# Altium schematic sheet IO2.SchDoc
size 359 x 219 mm; SheetNumber: 3; SheetTotal: 7
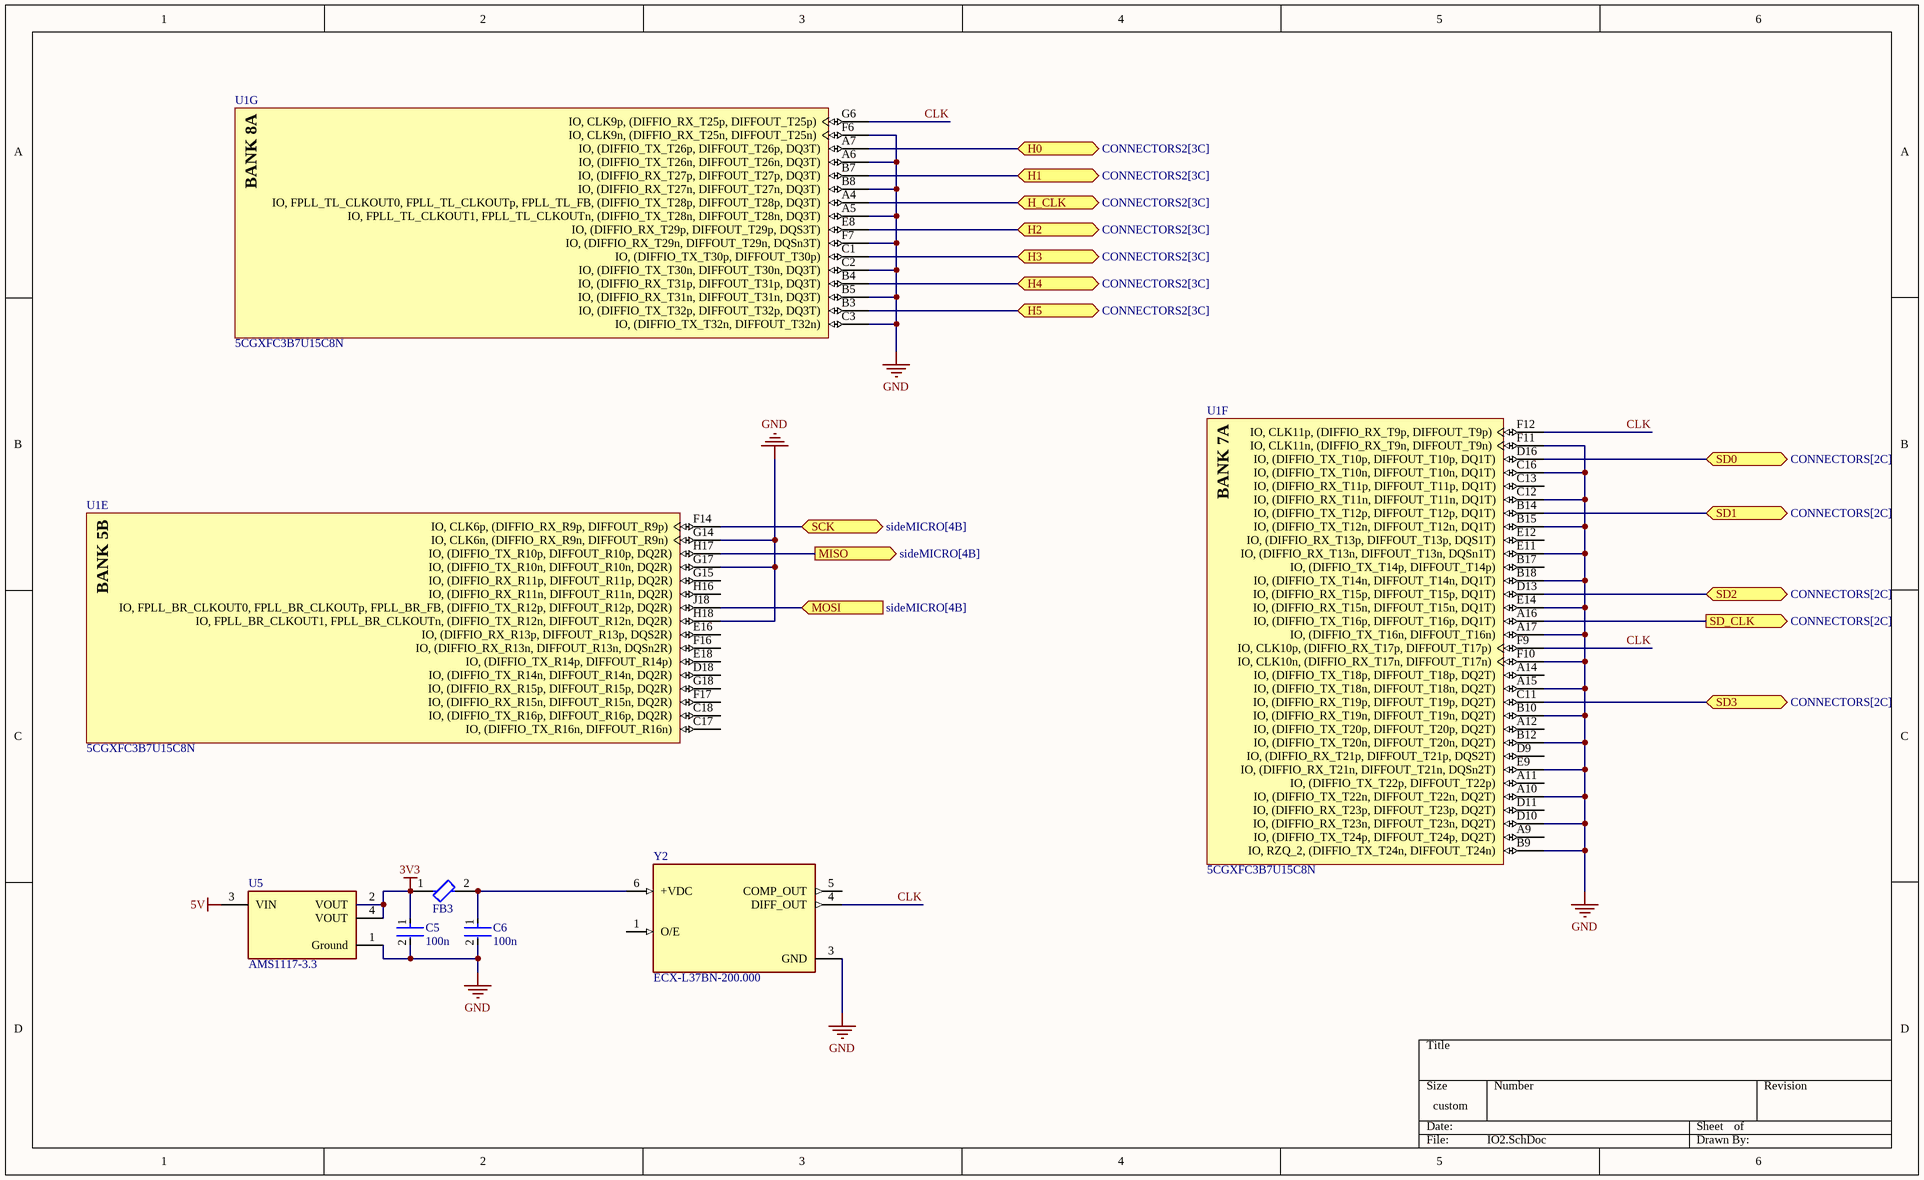
[diagram p0: IO2.SchDoc]

## Parts
C5  100n  [FP-CL10-IPC_C]
C6  100n  [FP-CL10-IPC_C]
FB3  BLM18KG121TN1D  [FP-BLM18-0_15-t0_6-d1_2-IPC_A]  (value not drawn)
U1  5CGXFC3B7U15C8N  [ALTR-UBGA324_A-150]  (parts E,F,G of 12)
U5  AMS1117-3.3  [FP-AMS1117-IPC_C]
Y2  ECX-L37BN-200.000  [OSC_ECX-L37BN-200.000]

## Ports
H0 (bidir, see CONNECTORS2[3C]), H1 (bidir, see CONNECTORS2[3C]), H2 (bidir, see CONNECTORS2[3C]), H3 (bidir, see CONNECTORS2[3C]), H4 (bidir, see CONNECTORS2[3C]), H5 (bidir, see CONNECTORS2[3C]), H_CLK (bidir, see CONNECTORS2[3C]), MISO (out, see sideMICRO[4B]), MOSI (in, see sideMICRO[4B]), SCK (bidir, see sideMICRO[4B]), SD0 (bidir, see CONNECTORS[2C]), SD1 (bidir, see CONNECTORS[2C]), SD2 (bidir, see CONNECTORS[2C]), SD3 (bidir, see CONNECTORS[2C]), SD_CLK (out, see CONNECTORS[2C])

## Nets
3V3: C5.1 FB3.1 U5.2(VOUT) U5.4(VOUT)
5V: U5.3(VIN)
GND: C5.2 C6.2 U1.A5(IO,_FPLL_TL_CLKOUT1,_FPLL_TL_CLKOUTn,_(DIFFIO_TX_T28n,_DIFFOUT_T28n,_DQ3T)) U1.A6(IO,_(DIFFIO_TX_T26n,_DIFFOUT_T26n,_DQ3T)) U1.A10(IO,_(DIFFIO_TX_T22n,_DIFFOUT_T22n,_DQ2T)) U1.A15(IO,_(DIFFIO_TX_T18n,_DIFFOUT_T18n,_DQ2T)) U1.A17(IO,_(DIFFIO_TX_T16n,_DIFFOUT_T16n)) U1.B5(IO,_(DIFFIO_RX_T31n,_DIFFOUT_T31n,_DQ3T)) U1.B8(IO,_(DIFFIO_RX_T27n,_DIFFOUT_T27n,_DQ3T)) U1.B9(IO,_RZQ_2,_(DIFFIO_TX_T24n,_DIFFOUT_T24n)) U1.B10(IO,_(DIFFIO_RX_T19n,_DIFFOUT_T19n,_DQ2T)) U1.B12(IO,_(DIFFIO_TX_T20n,_DIFFOUT_T20n,_DQ2T)) U1.B15(IO,_(DIFFIO_TX_T12n,_DIFFOUT_T12n,_DQ1T)) U1.B18(IO,_(DIFFIO_TX_T14n,_DIFFOUT_T14n,_DQ1T)) U1.C2(IO,_(DIFFIO_TX_T30n,_DIFFOUT_T30n,_DQ3T)) U1.C3(IO,_(DIFFIO_TX_T32n,_DIFFOUT_T32n)) U1.C12(IO,_(DIFFIO_RX_T11n,_DIFFOUT_T11n,_DQ1T)) U1.C16(IO,_(DIFFIO_TX_T10n,_DIFFOUT_T10n,_DQ1T)) U1.D10(IO,_(DIFFIO_RX_T23n,_DIFFOUT_T23n,_DQ2T)) U1.E9(IO,_(DIFFIO_RX_T21n,_DIFFOUT_T21n,_DQSn2T)) U1.E11(IO,_(DIFFIO_RX_T13n,_DIFFOUT_T13n,_DQSn1T)) U1.E14(IO,_(DIFFIO_RX_T15n,_DIFFOUT_T15n,_DQ1T)) U1.F6(IO,_CLK9n,_(DIFFIO_RX_T25n,_DIFFOUT_T25n)) U1.F7(IO,_(DIFFIO_RX_T29n,_DIFFOUT_T29n,_DQSn3T)) U1.F10(IO,_CLK10n,_(DIFFIO_RX_T17n,_DIFFOUT_T17n)) U1.F11(IO,_CLK11n,_(DIFFIO_RX_T9n,_DIFFOUT_T9n)) U1.G14(IO,_CLK6n,_(DIFFIO_RX_R9n,_DIFFOUT_R9n)) U1.G17(IO,_(DIFFIO_TX_R10n,_DIFFOUT_R10n,_DQ2R)) U1.H18(IO,_FPLL_BR_CLKOUT1,_FPLL_BR_CLKOUTn,_(DIFFIO_TX_R12n,_DIFFOUT_R12n,_DQ2R)) U5.1(Ground) Y2.3(GND)
CLK: U1.F9(IO,_CLK10p,_(DIFFIO_RX_T17p,_DIFFOUT_T17p)) U1.F12(IO,_CLK11p,_(DIFFIO_RX_T9p,_DIFFOUT_T9p)) U1.G6(IO,_CLK9p,_(DIFFIO_RX_T25p,_DIFFOUT_T25p)) Y2.4(DIFF_OUT)
H0: U1.A7(IO,_(DIFFIO_TX_T26p,_DIFFOUT_T26p,_DQ3T)) ; port H0
H1: U1.B7(IO,_(DIFFIO_RX_T27p,_DIFFOUT_T27p,_DQ3T)) ; port H1
H2: U1.E8(IO,_(DIFFIO_RX_T29p,_DIFFOUT_T29p,_DQS3T)) ; port H2
H3: U1.C1(IO,_(DIFFIO_TX_T30p,_DIFFOUT_T30p)) ; port H3
H4: U1.B4(IO,_(DIFFIO_RX_T31p,_DIFFOUT_T31p,_DQ3T)) ; port H4
H5: U1.B3(IO,_(DIFFIO_TX_T32p,_DIFFOUT_T32p,_DQ3T)) ; port H5
H_CLK: U1.A4(IO,_FPLL_TL_CLKOUT0,_FPLL_TL_CLKOUTp,_FPLL_TL_FB,_(DIFFIO_TX_T28p,_DIFFOUT_T28p,_DQ3T)) ; port H_CLK
MISO: U1.H17(IO,_(DIFFIO_TX_R10p,_DIFFOUT_R10p,_DQ2R)) ; port MISO
MOSI: U1.J18(IO,_FPLL_BR_CLKOUT0,_FPLL_BR_CLKOUTp,_FPLL_BR_FB,_(DIFFIO_TX_R12p,_DIFFOUT_R12p,_DQ2R)) ; port MOSI
SCK: U1.F14(IO,_CLK6p,_(DIFFIO_RX_R9p,_DIFFOUT_R9p)) ; port SCK
SD0: U1.D16(IO,_(DIFFIO_TX_T10p,_DIFFOUT_T10p,_DQ1T)) ; port SD0
SD1: U1.B14(IO,_(DIFFIO_TX_T12p,_DIFFOUT_T12p,_DQ1T)) ; port SD1
SD2: U1.D13(IO,_(DIFFIO_RX_T15p,_DIFFOUT_T15p,_DQ1T)) ; port SD2
SD3: U1.C11(IO,_(DIFFIO_RX_T19p,_DIFFOUT_T19p,_DQ2T)) ; port SD3
SD_CLK: U1.A16(IO,_(DIFFIO_TX_T16p,_DIFFOUT_T16p,_DQ1T)) ; port SD_CLK
NetC6_1: C6.1 FB3.2 Y2.6(+VDC)

Not connected (* = marked no-connect by the designer): U1 A9(IO,_(DIFFIO_TX_T24p,_DIFFOUT_T24p,_DQ2T)) A11(IO,_(DIFFIO_TX_T22p,_DIFFOUT_T22p)) A12(IO,_(DIFFIO_TX_T20p,_DIFFOUT_T20p,_DQ2T)) A14(IO,_(DIFFIO_TX_T18p,_DIFFOUT_T18p,_DQ2T)) B17(IO,_(DIFFIO_TX_T14p,_DIFFOUT_T14p)) C13(IO,_(DIFFIO_RX_T11p,_DIFFOUT_T11p,_DQ1T)) C17(IO,_(DIFFIO_TX_R16n,_DIFFOUT_R16n)) C18(IO,_(DIFFIO_TX_R16p,_DIFFOUT_R16p,_DQ2R)) D9(IO,_(DIFFIO_RX_T21p,_DIFFOUT_T21p,_DQS2T)) D11(IO,_(DIFFIO_RX_T23p,_DIFFOUT_T23p,_DQ2T)) D18(IO,_(DIFFIO_TX_R14n,_DIFFOUT_R14n,_DQ2R)) E12(IO,_(DIFFIO_RX_T13p,_DIFFOUT_T13p,_DQS1T)) E16(IO,_(DIFFIO_RX_R13p,_DIFFOUT_R13p,_DQS2R)) E18(IO,_(DIFFIO_TX_R14p,_DIFFOUT_R14p)) F16(IO,_(DIFFIO_RX_R13n,_DIFFOUT_R13n,_DQSn2R)) F17(IO,_(DIFFIO_RX_R15n,_DIFFOUT_R15n,_DQ2R)) G15(IO,_(DIFFIO_RX_R11p,_DIFFOUT_R11p,_DQ2R)) G18(IO,_(DIFFIO_RX_R15p,_DIFFOUT_R15p,_DQ2R)) H16(IO,_(DIFFIO_RX_R11n,_DIFFOUT_R11n,_DQ2R)); Y2 1(O/E) 5(COMP_OUT)

## Notes on the sheet
- (in symbol CMP-0469-00059-2, part E) BANK 5B
- (in symbol CMP-0469-00059-2, part F) BANK 7A
- (in symbol CMP-0469-00059-2, part G) BANK 8A

## Library data of the parts
C5 C6 = CMP-13271-003017-1: Cap Ceramic 4.7uF 10V X5R ±10% Pad SMD 0603 +85°C T/R; Capacitance: 4.7uF; Case/Package: 0603; Packaging: Tape and Reel; Width: 0.031inch; Contact Plating: Tin; Thickness: 0.035inch; Package Quantity: 1; Voltage Rating: 10V; Case Code (Metric): 1608; Case Code (Imperial): 0603; Depth: 0.8mm; Height: 0.8mm; Tolerance: 10%; Max Operating Temperature: 85°C; Length: 1.6mm; Dielectric: X5R; Mount: Surface Mount; Radiation Hardening: No; Min Operating Temperature: -55°C
FB3 = CMP-0686-00554-8: FERRITE BEAD 120 OHM 0603 1LN; Max Current Rating: 3A; DC Resistance (DCR): 30mR; Impedance: 120R; Number of Lines: 1; Test Frequency: 100MHz; Tolerance: 25%; Package Quantity: 4000; Min Operating Temperature: -55°C; Termination: SMD/SMT; REACH SVHC: No SVHC; Core Material: Ferrite; Material: Ferrite; Current Rating: 3A; Height: 0.8mm; Number of Pins: 2; Case/Package: 0603; Case Code (Imperial): 0603; Series: BLM18K; Packaging: Tape and Reel; Inductor Type: FERRITE BEAD; Lead Free: Lead Free; Width: 0.8mm; Case Code (Metric): 1608; Number of Circuits: 1; Max DC Current: 3A; Depth: 0.95mm; Max Operating Temperature: 125°C; Length: 1.6mm; RoHS Compliant: Yes
U1 = CMP-0469-00059-2: Cyclone V GX Family FPGA, 1.07 to 1.13 V Supply, 144 I/O Pins, 4 PLLs, 324-Pin UBGA, Speed Grade 8, Commercial Grade, RoHS Compliant; Manufacturer: Altera; Logic Elements (LE) (K): 31.5; GPIO: 144; Speed Grade: 8; ComponentLink1Description: Manufacturer URL; ComponentLink5URL: http://www.altera.com/literature/dp/cyclone-v/5CGXFC3.xls; ComponentLink7URL: http://www.buyaltera.com/scripts/partsearch.dll?Detail&name=544-2758-ND; Subcategory: Cyclone V GX; ComponentLink2Description: Datasheet; Voltage Supply: 1.07 to 1.13 V; PackageVersion: Rev. 1.0, 10/2011; ComponentLink7Description: Product URL; ComponentLink4Description: Device Handbook URL; Mounting Technology: Surface Mount; ComponentLink3URL: http://www.altera.com/devicepackaging/04R00433-00.pdf; Code_JEDEC: MO-216-BAK-1; ComponentLink1URL: http://www.altera.com; ComponentLink3Description: Package Specification; Device Group: 5CGXFC3; ComponentLink6URL: http://www.altera.com/literature/hb/cyclone-v/cv_51001.pdf; ComponentLink4URL: http://www.altera.com/literature/hb/cyclone-v/cyclone5_handbook.pdf; PackageDescription: 324-Pin Ultra FineLine Ball-Grid Array (UBGA), Body 15 x 15 mm, Pitch 0.8 mm; RoHS: RoHS Compliant; PackageReference: UBGA324_A-150; DatasheetVersion: Rev. 3.4; PartNumber: 5CGXFC3B7U15C8N; ComponentLink2URL: http://www.altera.com/literature/hb/cyclone-v/cv_51002.pdf; ComponentLink6Description: Device Overview URL; ComponentLink5Description: Device Pin-Out URL; NexusDeviceID: 5CGXFC3B7U15C8N
U5 = CMP-209535-000001-1: LDO Voltage Regulators 1A, 3.3V; Manufacturer: Advanced Monolithic Systems; Dropout Voltage: 1.1V; Output Type: Fixed; Nominal Supply Current: 5mA; Max Power Dissipation: 1.2W; Max Supply Voltage: 15V; Number Of Outputs: 1; Standoff Height: 0.64mm; Max Junction Temp: +125°C; Height: 1.8mm; Package: AMS1117; Device Class L2: Power Management ICs; ComponentLink2Description: Datasheet; ComponentLink2URL: http://www.advanced-monolithic.com/pdf/ds1117.pdf; Category: IC; RoHS: TRUE; Automotive: No; Device Class L1: Integrated Circuits (ICs); Output Current: 1A; Device Class L3: Voltage Regulators - Linear; Temperature: -40°C to +125°C; Output Voltage: 3.3V; Manufacturer Part Number: AMS1117-3.3; Temperature Range Low: -40°C; Octopart: https://octopart.com/ams1117-3.3-advanced+monolithic+systems-25899300; Lead Free: Yes; Ipc Land Pattern Name: SOT229P700X180-4; Temperature Range High: +125°C
Y2 = ECX-L37BN-200.000: 200 MHz XO (Standard) LVDS Oscillator 3.3V Enable/Disable 6-SMD, No Lead; MF: ECS Inc.; MP: ECX-L37BN-200.000; Package: SMD-6 ECS International; Purchase-URL: https://pricing.snapeda.com/search/part/ECX-L37BN-200.000/?ref=eda; Price: None; Value: *; SnapEDA_Link: https://www.snapeda.com/parts/ECX-L37BN-200.000/ECS+Inc./view-part/?ref=snap; Check_prices: https://www.snapeda.com/parts/ECX-L37BN-200.000/ECS+Inc./view-part/?ref=eda; Availability: In Stock